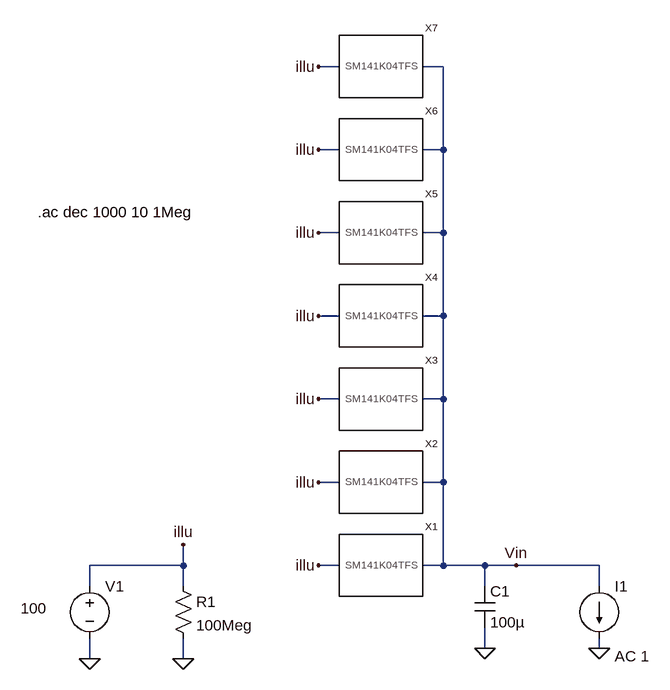
[diagram p0: schematic SM141K04TFS_Zin.asc]
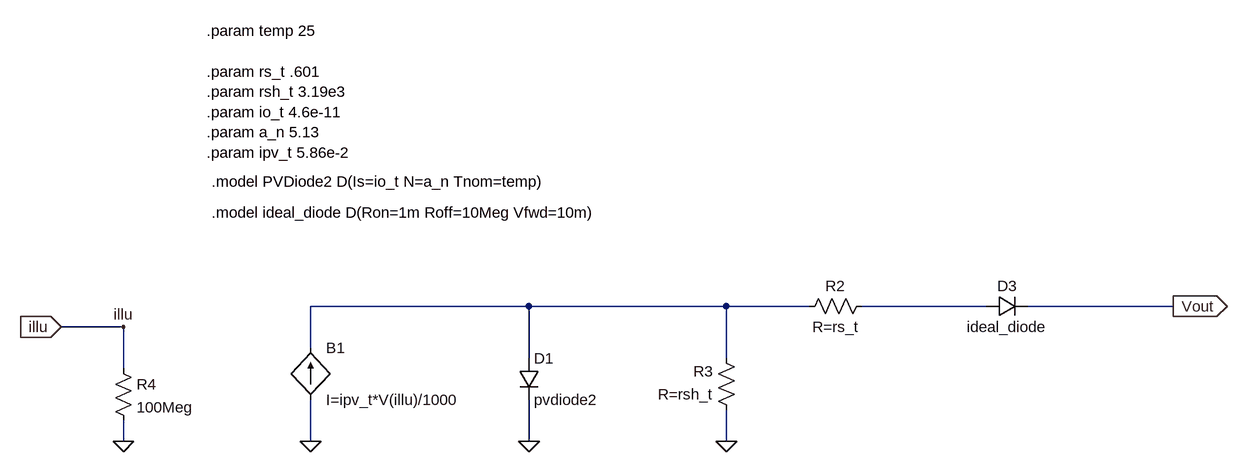
[diagram p1: sub-circuit sm141k04tfs.asc]
SM141K04TFS_Zin.asc, the LTspice schematic file:
Version 4
SHEET 1 992 964
WIRE 512 32 480 32
WIRE 672 32 640 32
WIRE 512 160 480 160
WIRE 672 160 672 32
WIRE 672 160 640 160
WIRE 512 288 480 288
WIRE 672 288 672 160
WIRE 672 288 640 288
WIRE 512 416 480 416
WIRE 672 416 672 288
WIRE 672 416 640 416
WIRE 512 544 480 544
WIRE 672 544 672 416
WIRE 672 544 640 544
WIRE 512 672 480 672
WIRE 672 672 672 544
WIRE 672 672 640 672
WIRE 272 800 272 768
WIRE 272 800 128 800
WIRE 512 800 480 800
WIRE 672 800 672 672
WIRE 672 800 640 800
WIRE 736 800 672 800
WIRE 784 800 736 800
WIRE 912 800 784 800
WIRE 128 832 128 800
WIRE 272 832 272 800
WIRE 736 832 736 800
WIRE 912 832 912 800
WIRE 736 928 736 896
WIRE 912 928 912 912
WIRE 128 944 128 912
WIRE 272 944 272 912
FLAG 480 800 illu
FLAG 272 768 illu
FLAG 272 944 0
FLAG 128 944 0
FLAG 784 800 Vin
FLAG 736 928 0
FLAG 480 672 illu
FLAG 480 544 illu
FLAG 480 416 illu
FLAG 480 288 illu
FLAG 480 160 illu
FLAG 480 32 illu
FLAG 912 928 0
SYMBOL SM141K04TFS 576 800 R0
SYMATTR InstName X1
SYMBOL res 256 816 R0
SYMATTR InstName R1
SYMATTR Value 100Meg
SYMBOL voltage 128 816 R0
WINDOW 3 -106 50 Left 2
WINDOW 123 0 0 Left 0
WINDOW 39 0 0 Left 0
SYMATTR InstName V1
SYMATTR Value 100
SYMBOL cap 720 832 R0
SYMATTR InstName C1
SYMATTR Value 100µ
SYMATTR SpiceLine Rser=5m
SYMBOL SM141K04TFS 576 672 R0
SYMATTR InstName X2
SYMBOL SM141K04TFS 576 544 R0
SYMATTR InstName X3
SYMBOL SM141K04TFS 576 416 R0
SYMATTR InstName X4
SYMBOL SM141K04TFS 576 288 R0
SYMATTR InstName X5
SYMBOL SM141K04TFS 576 160 R0
SYMATTR InstName X6
SYMBOL SM141K04TFS 576 32 R0
SYMATTR InstName X7
SYMBOL current 912 832 R0
WINDOW 123 24 108 Left 2
WINDOW 39 0 0 Left 0
SYMATTR InstName I1
SYMATTR Value ""
SYMATTR Value2 AC 1
TEXT 48 256 Left 2 !.ac dec 1000 10 1Meg

sm141k04tfs.asc, the sub-circuit schematic file:
Version 4
SHEET 1 1228 692
WIRE 64 80 -272 80
WIRE 368 80 64 80
WIRE 496 80 368 80
WIRE 768 80 576 80
WIRE 1056 80 832 80
WIRE -560 112 -656 112
WIRE -272 144 -272 80
WIRE 64 160 64 80
WIRE 368 160 368 80
WIRE -560 176 -560 112
WIRE -560 288 -560 256
WIRE -272 288 -272 224
WIRE 64 288 64 224
WIRE 368 288 368 240
FLAG 368 288 0
FLAG 64 288 0
FLAG -272 288 0
FLAG 1056 80 Vout
IOPIN 1056 80 Out
FLAG -656 112 illu
IOPIN -656 112 In
FLAG -560 112 illu
FLAG -560 288 0
SYMBOL res 592 64 R90
WINDOW 0 0 56 VBottom 2
WINDOW 3 32 56 VTop 2
SYMATTR InstName R2
SYMATTR Value R=rs_t
SYMBOL res 384 256 R180
WINDOW 0 36 76 Left 2
WINDOW 3 36 40 Left 2
SYMATTR InstName R3
SYMATTR Value R=rsh_t
SYMBOL diode 48 160 R0
SYMATTR InstName D1
SYMATTR Value pvdiode2
SYMBOL bi2 -272 144 R0
SYMATTR InstName B1
SYMATTR Value I=ipv_t*V(illu)/1000
SYMBOL diode 768 96 R270
WINDOW 0 32 32 VTop 2
WINDOW 3 0 32 VBottom 2
SYMATTR InstName D3
SYMATTR Value ideal_diode
SYMBOL res -576 160 R0
SYMATTR InstName R4
SYMATTR Value 100Meg
TEXT -424 -112 Left 2 !.model PVDiode2 D(Is=io_t N=a_n Tnom=temp)
TEXT -432 -344 Left 2 !.param temp 25\n \n.param rs_t .601\n.param rsh_t 3.19e3\n.param io_t 4.6e-11\n.param a_n 5.13\n.param ipv_t 5.86e-2
TEXT -424 -64 Left 2 !.model ideal_diode D(Ron=1m Roff=10Meg Vfwd=10m)

The netlist it stands for:
* SM141K04TFS_Zin.asc
XX1 illu Vin sm141k04tfs
R1 illu 0 100Meg
V1 illu 0 100
C1 Vin 0 100µ Rser=5m
XX2 illu Vin sm141k04tfs
XX3 illu Vin sm141k04tfs
XX4 illu Vin sm141k04tfs
XX5 illu Vin sm141k04tfs
XX6 illu Vin sm141k04tfs
XX7 illu Vin sm141k04tfs
I1 Vin 0 AC 1

* block symbol definitions
.subckt sm141k04tfs Illu Vout
R2 N002 N001 R=rs_t
R3 0 N001 R=rsh_t
D1 N001 0 pvdiode2
B1 0 N001 I=ipv_t*V(illu)/1000
D3 N002 Vout ideal_diode
R4 illu 0 100Meg
.model PVDiode2 D(Is=io_t N=a_n Tnom=temp)
.param temp 25
.param rs_t .601
.param rsh_t 3.19e3
.param io_t 4.6e-11
.param a_n 5.13
.param ipv_t 5.86e-2
.model ideal_diode D(Ron=1m Roff=10Meg Vfwd=10m)
.ends sm141k04tfs

.model D D
.lib standard.dio
.ac dec 1000 10 1Meg
.backanno
.end